# EAGLE schematic OwlOrbOfProtection (EAGLE 9.6.2)
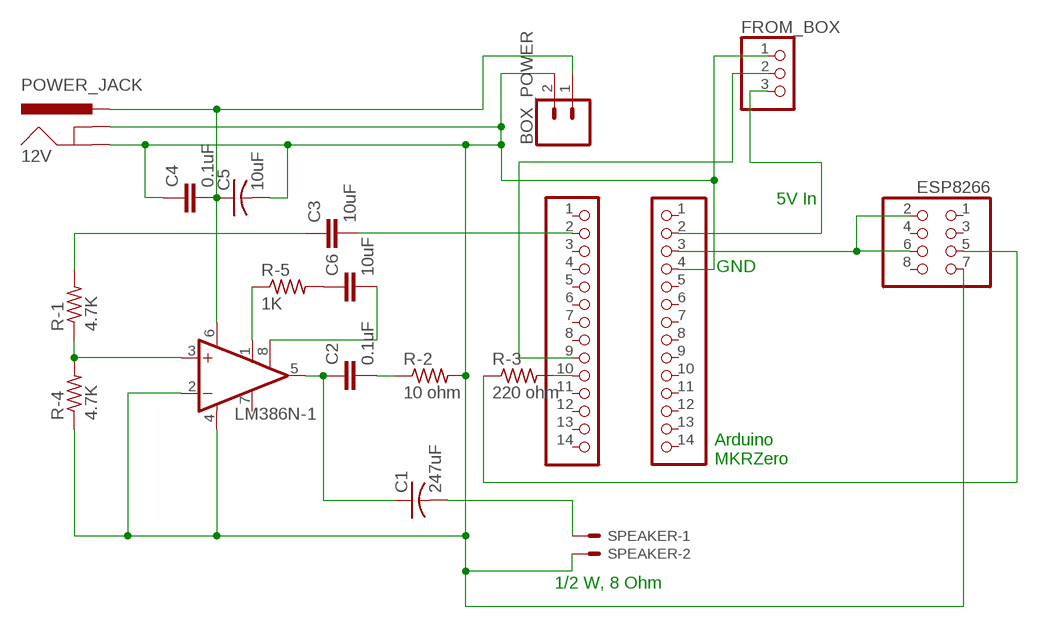
[diagram p0: schematic, sheet 1]

## Parts
12V  POWER_JACK  [POWER_JACK_PTH]
BOX_POWER  CONN_023.5MM  [SCREWTERMINAL-3.5MM-2]
C1  247uF  C-US025-024X044  [C025-024X044]
C2  0.1uF  C2,5-3  [C2.5-3]
C3  10uF  C2,5-3  [C2.5-3]
C4  0.1uF  C2,5-3  [C2.5-3]
C5  10uF  C-US025-024X044  [C025-024X044]
C6  10uF  C2,5-3  [C2.5-3]
ESP8266  PINHD-2X4  [2X04]
FROM_BOX  PINHD-1X3  [1X03]
IC2  LM386N-1  [DIL08]
JP1  PINHD-1X14  [1X14]
JP2  PINHD-1X14  [1X14]
R-1  4.7K  R-US_0207/10  [0207/10]
R-2  10 ohm  R-US_0207/10  [0207/10]
R-3  220 ohm  R-US_0207/10  [0207/10]
R-4  4.7K  R-US_0207/10  [0207/10]
R-5  1K  R-US_0207/10  [0207/10]
SPEAKER  22-23-2021  [22-23-2021]

## Nets
3.3V: ESP8266.2 ESP8266.6 JP2.3
5V: FROM_BOX.3 JP2.2
12V: 12V.PWR BOX_POWER.1 C4.2 C5.1 IC2.6(VS)
GND: 12V.GND 12V.GNDBREAK BOX_POWER.2 C4.1 C5.2 ESP8266.7 FROM_BOX.1 IC2.2(-IN) IC2.4(GND) JP2.4 R-2.2 R-4.1 SPEAKER.2
N$1: FROM_BOX.2 JP1.9
N$2: C2.2 R-2.1
N$3: C1.1 C2.1 IC2.5(OUT)
N$4: ESP8266.5 R-3.1
N$5: IC2.3(+IN) R-1.1 R-4.2
N$6: C3.1 R-1.2
N$7: C1.2 SPEAKER.1
N$8: C3.2 JP1.2
N$9: IC2.1(GAIN) R-5.1
N$10: JP1.10 R-3.2
N$11: C6.1 R-5.2
N$12: C6.2 IC2.8(GAIN)
Unconnected: ESP8266.1 ESP8266.3 ESP8266.4 ESP8266.8 IC2.7(BYPASS) JP1.1 JP1.3 JP1.4 JP1.5 JP1.6 JP1.7 JP1.8 JP1.11 JP1.12 JP1.13 JP1.14 JP2.1 JP2.5 JP2.6 JP2.7 JP2.8 JP2.9 JP2.10 JP2.11 JP2.12 JP2.13 JP2.14

## Notes on the sheet
- 5V In
- GND
- Arduino
  MKRZero
- 1/2 W, 8 Ohm

## Library data of the parts
12V = SparkFun-Connectors:POWER_JACK: Power Jack Connector This is the standard 5.5mm barrel jack for power. The PTH is the most common, proven, reliable, footprint. The Slot footprint only works if the mill layer is transmitted to the PCB fab house so be warned. Here are the connectors we sell at SparkFun: DC Barrel Power Jack/Connector <https://www.sparkfun.com/products/119> (PRT-00119) DC Barrel Power Jack/Connector (SMD) <https://www.sparkfun.com/products/12748> (PRT-12748) DC Barrel Jack Adapter - Breadboard Compatible <https://www.sparkfun.com/products/10811> (PRT-10811) It is used on this SparkFun product (and many, many others): SparkFun RedBoard - Programmed with Arduino <https://www.sparkfun.com/products/12757> (DEV-12757) Also, if you need a mating power supply or connector, please check these out: Wall Adapter Power Supply - 9VDC 650mA <https://www.sparkfun.com/products/298> (TOL-00298) DC Barrel Jack Adapter - Male <https://www.sparkfun.com/products/10287> (PRT-10287); PROD_ID: CONN-08197
BOX_POWER = SparkFun-Connectors:CONN_02: Multi connection point. Often used as Generic Header-pin footprint for 0.1 inch spaced/style header connections On any of the 0.1 inch spaced packages, you can populate with these: Break Away Headers - Straight <https://www.sparkfun.com/products/116> (PRT-00116) Break Away Male Headers - Right Angle <https://www.sparkfun.com/products/553> (PRT-00553) Female Headers <https://www.sparkfun.com/products/115> (PRT-00115) Break Away Headers - Machine Pin <https://www.sparkfun.com/products/117> (PRT-00117) Break Away Female Headers - Swiss Machine Pin <https://www.sparkfun.com/products/743> (PRT-00743) For SCREWTERMINALS and SPRING TERMINALS visit here: Screw Terimnals on SparkFun.com <https://www.sparkfun.com/search/results?term=Screw+Terminals> (5mm/3.5mm/2.54mm spacing) This device is also useful as a general connection point to wire up your design to another part of your project. Our various solder wires solder well into these plated through hole pads. Hook-Up Wire - Assortment (Stranded, 22 AWG) <https://www.sparkfun.com/products/11375> (PRT-11375) Hook-Up Wire - Assortment (Solid Core, 22 AWG) <https://www.sparkfun.com/products/11367> (PRT-11367) View the entire wire category on our website here <https://www.sparkfun.com/categories/141> Special notes: Molex polarized connector foot print use with: PRT-08233 with associated crimp pins and housings. 2.54_SCREWTERM for use with PRT-10571. 3.5mm Screw Terminal footprints for PRT-08084 5mm Screw Terminal footprints for use with PRT-08432; PROD_ID: CONN-08399
C1 C5 = adafruit:C-US: CAPACITOR, American symbol
C2-C4 C6 = capacitor-wima:C: CAPACITOR naming: grid - package width
ESP8266 = adafruit:PINHD-2X4: PIN HEADER
FROM_BOX = adafruit:PINHD-1X3: PIN HEADER
IC2 = linear:LM386?-*: Low Voltage Audio Power Amplifier Source: http://cache.national.com/ds/LM/LM386.pdf
JP1 JP2 = adafruit:PINHD-1X14: PIN HEADER
R-1-R-5 = adafruit:R-US_: RESISTOR, American symbol
SPEAKER = con-molex:22-23-2021: .100" (2.54mm) Center Header - 2 Pin; MF: MOLEX; MPN: 22-23-2021; OC_FARNELL: 1462926; OC_NEWARK: 25C3832